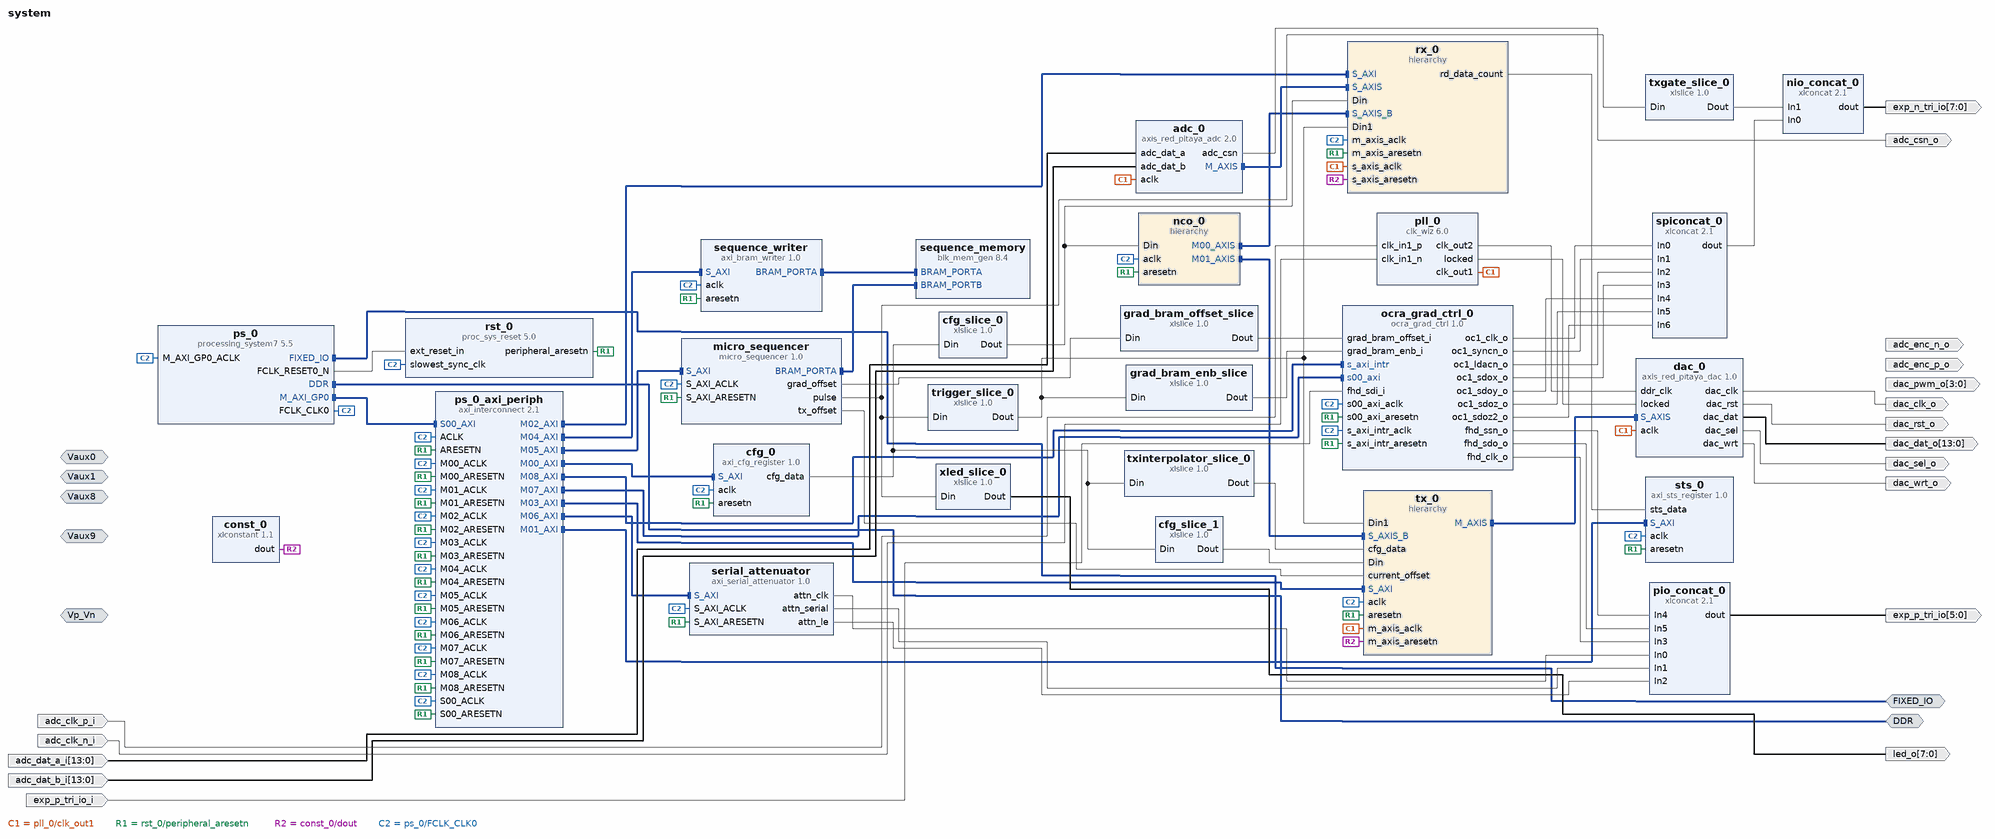
[diagram p0: block diagram of the top level]
# Vivado block design system, xc7z010clg400-1, Vivado 2019.2
create_bd_design system

create_bd_intf_port -mode Slave -vlnv xilinx.com:interface:diff_analog_io_rtl:1.0 Vp_Vn
create_bd_intf_port -mode Slave -vlnv xilinx.com:interface:diff_analog_io_rtl:1.0 Vaux0
create_bd_intf_port -mode Slave -vlnv xilinx.com:interface:diff_analog_io_rtl:1.0 Vaux1
create_bd_intf_port -mode Slave -vlnv xilinx.com:interface:diff_analog_io_rtl:1.0 Vaux9
create_bd_intf_port -mode Slave -vlnv xilinx.com:interface:diff_analog_io_rtl:1.0 Vaux8
create_bd_intf_port -mode Master -vlnv xilinx.com:interface:ddrx_rtl:1.0 DDR
create_bd_intf_port -mode Master -vlnv xilinx.com:display_processing_system7:fixedio_rtl:1.0 FIXED_IO
create_bd_port -dir I -from 13 -to 0 adc_dat_a_i
create_bd_port -dir I -from 13 -to 0 adc_dat_b_i
create_bd_port -dir I adc_clk_p_i
create_bd_port -dir I adc_clk_n_i
create_bd_port -dir O adc_enc_p_o
create_bd_port -dir O adc_enc_n_o
create_bd_port -dir O adc_csn_o
create_bd_port -dir O -from 13 -to 0 dac_dat_o
create_bd_port -dir O dac_clk_o
create_bd_port -dir O dac_rst_o
create_bd_port -dir O dac_sel_o
create_bd_port -dir O dac_wrt_o
create_bd_port -dir O -from 3 -to 0 dac_pwm_o
create_bd_port -dir O -from 7 -to 0 led_o
create_bd_port -dir O -from 5 -to 0 exp_p_tri_io
create_bd_port -dir O -from 7 -to 0 exp_n_tri_io
create_bd_port -dir I -type data exp_p_tri_io_i

create_bd_cell -type ip -vlnv xilinx.com:ip:processing_system7:5.5 ps_0
set_property -dict [list \
  CONFIG.PCW_APU_PERIPHERAL_FREQMHZ 666.666666 \
  CONFIG.PCW_ENET0_ENET0_IO {MIO 16 .. 27} \
  CONFIG.PCW_ENET0_GRP_MDIO_ENABLE 1 \
  CONFIG.PCW_ENET0_GRP_MDIO_IO {MIO 52 .. 53} \
  CONFIG.PCW_ENET0_PERIPHERAL_ENABLE 1 \
  CONFIG.PCW_ENET0_RESET_ENABLE 0 \
  CONFIG.PCW_ENET_RESET_ENABLE 1 \
  CONFIG.PCW_ENET_RESET_SELECT {Share reset pin} \
  CONFIG.PCW_FPGA0_PERIPHERAL_FREQMHZ 143 \
  CONFIG.PCW_FPGA1_PERIPHERAL_FREQMHZ 50 \
  CONFIG.PCW_GPIO_EMIO_GPIO_ENABLE 1 \
  CONFIG.PCW_GPIO_EMIO_GPIO_IO 64 \
  CONFIG.PCW_GPIO_MIO_GPIO_ENABLE 1 \
  CONFIG.PCW_GPIO_MIO_GPIO_IO MIO \
  CONFIG.PCW_GPIO_PERIPHERAL_ENABLE 1 \
  CONFIG.PCW_I2C0_GRP_INT_ENABLE 0 \
  CONFIG.PCW_I2C0_I2C0_IO {MIO 50 .. 51} \
  CONFIG.PCW_I2C0_PERIPHERAL_ENABLE 1 \
  CONFIG.PCW_I2C_PERIPHERAL_FREQMHZ 111.111115 \
  CONFIG.PCW_I2C_RESET_ENABLE 1 \
  CONFIG.PCW_I2C_RESET_SELECT {Share reset pin} \
  CONFIG.PCW_IMPORT_BOARD_PRESET cfg/red_pitaya.xml \
  CONFIG.PCW_PRESET_BANK1_VOLTAGE {LVCMOS 2.5V} \
  CONFIG.PCW_QSPI_GRP_SINGLE_SS_ENABLE 1 \
  CONFIG.PCW_QSPI_GRP_SINGLE_SS_IO {MIO 1 .. 6} \
  CONFIG.PCW_QSPI_PERIPHERAL_ENABLE 1 \
  CONFIG.PCW_QSPI_PERIPHERAL_FREQMHZ 125 \
  CONFIG.PCW_QSPI_QSPI_IO {MIO 1 .. 6} \
  CONFIG.PCW_SD0_GRP_CD_ENABLE 1 \
  CONFIG.PCW_SD0_GRP_CD_IO {MIO 46} \
  CONFIG.PCW_SD0_GRP_WP_ENABLE 1 \
  CONFIG.PCW_SD0_GRP_WP_IO {MIO 47} \
  CONFIG.PCW_SD0_PERIPHERAL_ENABLE 1 \
  CONFIG.PCW_SD0_SD0_IO {MIO 40 .. 45} \
  CONFIG.PCW_SDIO_PERIPHERAL_FREQMHZ 100 \
  CONFIG.PCW_SINGLE_QSPI_DATA_MODE x4 \
  CONFIG.PCW_SPI0_PERIPHERAL_ENABLE 1 \
  CONFIG.PCW_SPI0_SPI0_IO EMIO \
  CONFIG.PCW_SPI1_PERIPHERAL_ENABLE 1 \
  CONFIG.PCW_SPI1_SPI1_IO {MIO 10 .. 15} \
  CONFIG.PCW_TTC0_PERIPHERAL_ENABLE 1 \
  CONFIG.PCW_TTC0_TTC0_IO EMIO \
  CONFIG.PCW_UART0_PERIPHERAL_ENABLE 1 \
  CONFIG.PCW_UART0_UART0_IO {MIO 14 .. 15} \
  CONFIG.PCW_UART1_PERIPHERAL_ENABLE 1 \
  CONFIG.PCW_UART1_UART1_IO {MIO 8 .. 9} \
  CONFIG.PCW_UART_PERIPHERAL_FREQMHZ 100 \
  CONFIG.PCW_UIPARAM_DDR_BUS_WIDTH {16 Bit} \
  CONFIG.PCW_UIPARAM_DDR_FREQ_MHZ 533.333333 \
  CONFIG.PCW_UIPARAM_DDR_PARTNO {MT41J256M16 RE-125} \
  CONFIG.PCW_USB0_PERIPHERAL_ENABLE 1 \
  CONFIG.PCW_USB0_RESET_ENABLE 1 \
  CONFIG.PCW_USB0_RESET_IO {MIO 48} \
  CONFIG.PCW_USB0_USB0_IO {MIO 28 .. 39} \
  CONFIG.PCW_USB_RESET_ENABLE 1 \
  CONFIG.PCW_USB_RESET_SELECT {Share reset pin} \
] [get_bd_cells ps_0]
# 430 more settings of ps_0 are not shown: defaults, MIO pin electricals, DDR timing, and values the tool derives
create_bd_cell -type ip -vlnv xilinx.com:ip:proc_sys_reset:5.0 rst_0
create_bd_cell -type ip -vlnv xilinx.com:ip:clk_wiz:6.0 pll_0
set_property -dict [list \
  CONFIG.CLKOUT1_REQUESTED_OUT_FREQ 125.0 \
  CONFIG.CLKOUT1_USED true \
  CONFIG.CLKOUT2_REQUESTED_OUT_FREQ 250.0 \
  CONFIG.CLKOUT2_REQUESTED_PHASE -90.0 \
  CONFIG.CLKOUT2_USED true \
  CONFIG.PRIMITIVE PLL \
  CONFIG.PRIM_IN_FREQ 125.0 \
  CONFIG.PRIM_SOURCE Differential_clock_capable_pin \
  CONFIG.USE_RESET false \
] [get_bd_cells pll_0]
create_bd_cell -type ip -vlnv pavel-demin:user:axis_red_pitaya_adc:2.0 adc_0
create_bd_cell -type ip -vlnv pavel-demin:user:axis_red_pitaya_dac:1.0 dac_0
create_bd_cell -type ip -vlnv pavel-demin:user:axi_cfg_register:1.0 cfg_0
set_property -dict {CONFIG.AXI_ADDR_WIDTH 32 CONFIG.AXI_DATA_WIDTH 32 CONFIG.CFG_DATA_WIDTH 128} [get_bd_cells cfg_0]
create_bd_cell -type ip -vlnv xilinx.com:ip:xlslice:1.0 txinterpolator_slice_0
set_property -dict [list \
  CONFIG.DIN_FROM 31 \
  CONFIG.DIN_TO 0 \
  CONFIG.DIN_WIDTH 128 \
  CONFIG.DOUT_WIDTH 32 \
] [get_bd_cells txinterpolator_slice_0]
create_bd_cell -type ip -vlnv xilinx.com:ip:xlslice:1.0 cfg_slice_0
set_property -dict {CONFIG.DIN_FROM 95 CONFIG.DIN_TO 32 CONFIG.DIN_WIDTH 128 CONFIG.DOUT_WIDTH 64} [get_bd_cells cfg_slice_0]
create_bd_cell -type ip -vlnv xilinx.com:ip:xlslice:1.0 cfg_slice_1
set_property -dict {CONFIG.DIN_FROM 127 CONFIG.DIN_TO 96 CONFIG.DIN_WIDTH 128 CONFIG.DOUT_WIDTH 32} [get_bd_cells cfg_slice_1]
create_bd_cell -type ip -vlnv xilinx.com:ip:xlconstant:1.1 const_0
create_bd_cell -type hier rx_0
create_bd_cell -type hier tx_0
create_bd_cell -type hier nco_0
create_bd_cell -type ip -vlnv pavel-demin:user:axi_sts_register:1.0 sts_0
set_property -dict {CONFIG.AXI_ADDR_WIDTH 32 CONFIG.AXI_DATA_WIDTH 32 CONFIG.STS_DATA_WIDTH 32} [get_bd_cells sts_0]
create_bd_cell -type ip -vlnv xilinx.com:ip:axi_interconnect:2.1 ps_0_axi_periph
set_property -dict {CONFIG.ENABLE_ADVANCED_OPTIONS 0 CONFIG.NUM_MI 9} [get_bd_cells ps_0_axi_periph]
create_bd_cell -type ip -vlnv xilinx.com:ip:blk_mem_gen:8.4 sequence_memory
set_property -dict [list \
  CONFIG.Enable_A Always_Enabled \
  CONFIG.Enable_B Always_Enabled \
  CONFIG.Memory_Type Simple_Dual_Port_RAM \
  CONFIG.Register_PortB_Output_of_Memory_Core false \
  CONFIG.Register_PortB_Output_of_Memory_Primitives true \
  CONFIG.Write_Depth_A 16384 \
  CONFIG.Write_Width_A 32 \
  CONFIG.Write_Width_B 64 \
  CONFIG.use_bram_block Stand_Alone \
] [get_bd_cells sequence_memory]
create_bd_cell -type ip -vlnv pavel-demin:user:axi_bram_writer:1.0 sequence_writer
set_property -dict [list \
  CONFIG.AXI_ADDR_WIDTH 32 \
  CONFIG.AXI_DATA_WIDTH 32 \
  CONFIG.BRAM_ADDR_WIDTH 14 \
  CONFIG.BRAM_DATA_WIDTH 32 \
] [get_bd_cells sequence_writer]
create_bd_cell -type ip -vlnv open-mri:user:micro_sequencer:1.0 micro_sequencer
set_property -dict [list \
  CONFIG.BRAM_ADDR_WIDTH 13 \
  CONFIG.BRAM_DATA_WIDTH 64 \
  CONFIG.C_S_AXI_ADDR_WIDTH 32 \
  CONFIG.C_S_AXI_DATA_WIDTH 32 \
] [get_bd_cells micro_sequencer]
create_bd_cell -type ip -vlnv open-mri:user:axi_serial_attenuator:1.0 serial_attenuator
set_property -dict {CONFIG.C_S_AXI_ADDR_WIDTH 16 CONFIG.C_S_AXI_DATA_WIDTH 32} [get_bd_cells serial_attenuator]
create_bd_cell -type ip -vlnv xilinx.com:ip:xlslice:1.0 xled_slice_0
set_property -dict {CONFIG.DIN_FROM 15 CONFIG.DIN_TO 8 CONFIG.DIN_WIDTH 64 CONFIG.DOUT_WIDTH 8} [get_bd_cells xled_slice_0]
create_bd_cell -type ip -vlnv xilinx.com:ip:xlslice:1.0 trigger_slice_0
set_property -dict {CONFIG.DIN_FROM 7 CONFIG.DIN_TO 0 CONFIG.DIN_WIDTH 64 CONFIG.DOUT_WIDTH 8} [get_bd_cells trigger_slice_0]
create_bd_cell -type ip -vlnv xilinx.com:ip:xlslice:1.0 txgate_slice_0
set_property -dict {CONFIG.DIN_FROM 4 CONFIG.DIN_TO 4 CONFIG.DIN_WIDTH 64 CONFIG.DOUT_WIDTH 1} [get_bd_cells txgate_slice_0]
create_bd_cell -type ip -vlnv xilinx.com:ip:xlconcat:2.1 nio_concat_0
set_property -dict {CONFIG.NUM_PORTS 2} [get_bd_cells nio_concat_0]
create_bd_cell -type ip -vlnv xilinx.com:ip:xlconcat:2.1 pio_concat_0
set_property -dict {CONFIG.NUM_PORTS 6} [get_bd_cells pio_concat_0]
create_bd_cell -type ip -vlnv xilinx.com:ip:xlslice:1.0 grad_bram_offset_slice
set_property -dict {CONFIG.DIN_FROM 13 CONFIG.DIN_WIDTH 16 CONFIG.DOUT_WIDTH 14} [get_bd_cells grad_bram_offset_slice]
create_bd_cell -type ip -vlnv xilinx.com:ip:xlslice:1.0 grad_bram_enb_slice
set_property -dict {CONFIG.DIN_FROM 2 CONFIG.DIN_TO 2 CONFIG.DIN_WIDTH 8 CONFIG.DOUT_WIDTH 1} [get_bd_cells grad_bram_enb_slice]
create_bd_cell -type ip -vlnv xilinx.com:ip:xlconcat:2.1 spiconcat_0
set_property -dict {CONFIG.NUM_PORTS 7} [get_bd_cells spiconcat_0]
create_bd_cell -type ip -vlnv ocra:ocra:ocra_grad_ctrl:1.0 ocra_grad_ctrl_0

# ---- hierarchy /rx_0 ----
current_bd_instance /rx_0
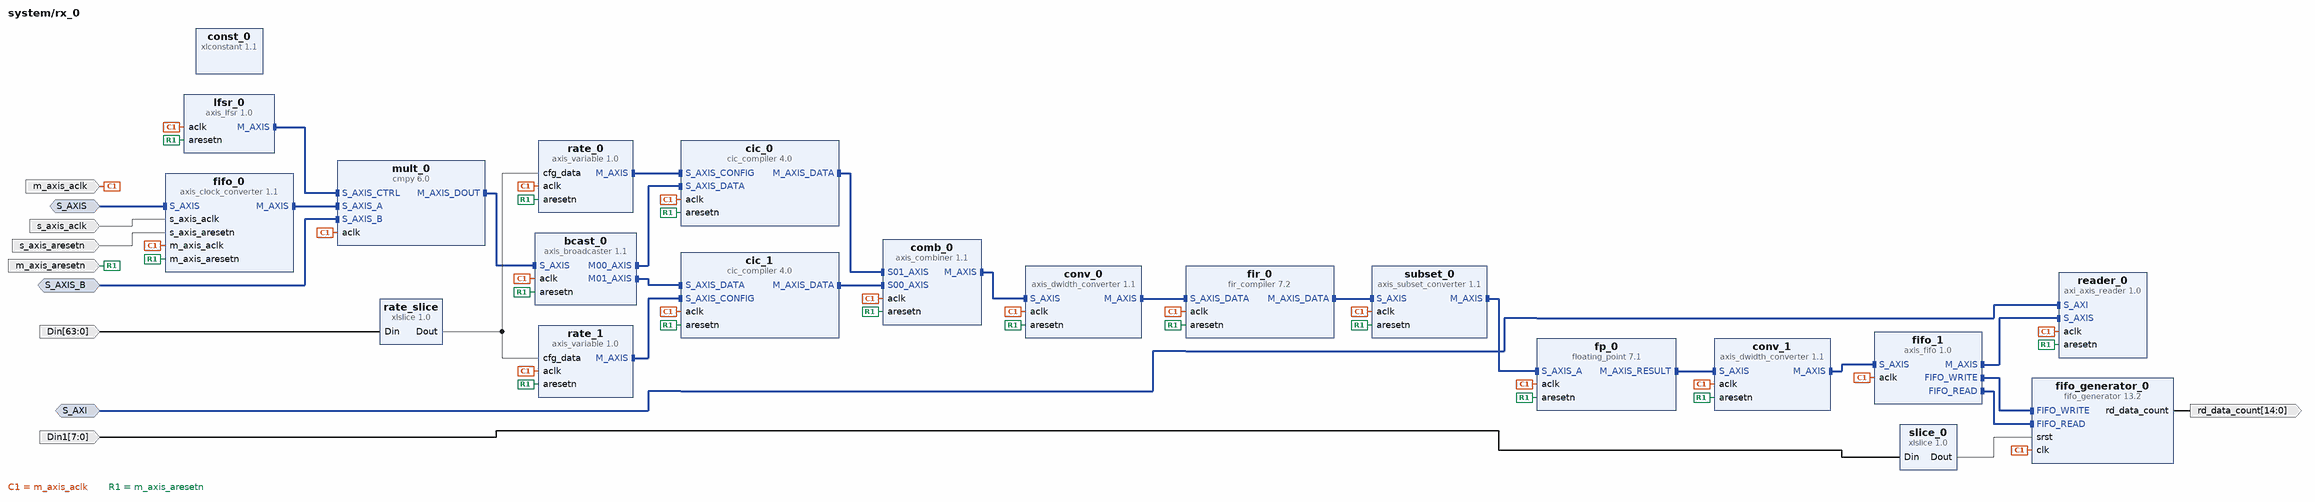
[diagram p1: block diagram inside /rx_0]
create_bd_intf_pin -mode Slave -vlnv xilinx.com:interface:axis_rtl:1.0 S_AXIS
create_bd_intf_pin -mode Slave -vlnv xilinx.com:interface:axis_rtl:1.0 S_AXIS_B
create_bd_intf_pin -mode Slave -vlnv xilinx.com:interface:aximm_rtl:1.0 S_AXI
create_bd_pin -dir I -type clk m_axis_aclk
create_bd_pin -dir I -type rst m_axis_aresetn
create_bd_pin -dir I -from 63 -to 0 Din
create_bd_pin -dir I -type clk s_axis_aclk
create_bd_pin -dir I -type rst s_axis_aresetn
create_bd_pin -dir O -from 14 -to 0 rd_data_count
create_bd_pin -dir I -from 7 -to 0 Din1

create_bd_cell -type ip -vlnv xilinx.com:ip:xlslice:1.0 slice_0
set_property -dict {CONFIG.DIN_FROM 1 CONFIG.DIN_TO 1 CONFIG.DIN_WIDTH 8 CONFIG.DOUT_WIDTH 1} [get_bd_cells slice_0]
create_bd_cell -type ip -vlnv xilinx.com:ip:xlslice:1.0 rate_slice
set_property -dict {CONFIG.DIN_FROM 47 CONFIG.DIN_TO 32 CONFIG.DIN_WIDTH 64 CONFIG.DOUT_WIDTH 16} [get_bd_cells rate_slice]
create_bd_cell -type ip -vlnv xilinx.com:ip:xlconstant:1.1 const_0
create_bd_cell -type ip -vlnv xilinx.com:ip:axis_clock_converter:1.1 fifo_0
set_property -dict {CONFIG.TDATA_NUM_BYTES 2} [get_bd_cells fifo_0]
create_bd_cell -type ip -vlnv pavel-demin:user:axis_lfsr:1.0 lfsr_0
create_bd_cell -type ip -vlnv xilinx.com:ip:cmpy:6.0 mult_0
set_property -dict [list \
  CONFIG.APortWidth 14 \
  CONFIG.BPortWidth 24 \
  CONFIG.FlowControl Blocking \
  CONFIG.OutputWidth 26 \
  CONFIG.RoundMode Random_Rounding \
] [get_bd_cells mult_0]
create_bd_cell -type ip -vlnv xilinx.com:ip:axis_broadcaster:1.1 bcast_0
set_property -dict [list \
  CONFIG.M00_TDATA_REMAP {tdata[23:0]} \
  CONFIG.M01_TDATA_REMAP {tdata[55:32]} \
  CONFIG.M_TDATA_NUM_BYTES 3 \
  CONFIG.S_TDATA_NUM_BYTES 8 \
] [get_bd_cells bcast_0]
create_bd_cell -type ip -vlnv pavel-demin:user:axis_variable:1.0 rate_0
set_property -dict {CONFIG.AXIS_TDATA_WIDTH 16} [get_bd_cells rate_0]
create_bd_cell -type ip -vlnv pavel-demin:user:axis_variable:1.0 rate_1
set_property -dict {CONFIG.AXIS_TDATA_WIDTH 16} [get_bd_cells rate_1]
create_bd_cell -type ip -vlnv xilinx.com:ip:cic_compiler:4.0 cic_0
set_property -dict [list \
  CONFIG.Clock_Frequency 125 \
  CONFIG.Filter_Type Decimation \
  CONFIG.Fixed_Or_Initial_Rate 625 \
  CONFIG.HAS_ARESETN true \
  CONFIG.HAS_DOUT_TREADY true \
  CONFIG.Input_Data_Width 24 \
  CONFIG.Input_Sample_Frequency 125 \
  CONFIG.Maximum_Rate 8192 \
  CONFIG.Minimum_Rate 25 \
  CONFIG.Number_Of_Stages 6 \
  CONFIG.Output_Data_Width 24 \
  CONFIG.Quantization Truncation \
  CONFIG.Sample_Rate_Changes Programmable \
  CONFIG.Use_Xtreme_DSP_Slice false \
] [get_bd_cells cic_0]
create_bd_cell -type ip -vlnv xilinx.com:ip:cic_compiler:4.0 cic_1
set_property -dict [list \
  CONFIG.Clock_Frequency 125 \
  CONFIG.Filter_Type Decimation \
  CONFIG.Fixed_Or_Initial_Rate 625 \
  CONFIG.HAS_ARESETN true \
  CONFIG.HAS_DOUT_TREADY true \
  CONFIG.Input_Data_Width 24 \
  CONFIG.Input_Sample_Frequency 125 \
  CONFIG.Maximum_Rate 8192 \
  CONFIG.Minimum_Rate 25 \
  CONFIG.Number_Of_Stages 6 \
  CONFIG.Output_Data_Width 24 \
  CONFIG.Quantization Truncation \
  CONFIG.Sample_Rate_Changes Programmable \
  CONFIG.Use_Xtreme_DSP_Slice false \
] [get_bd_cells cic_1]
create_bd_cell -type ip -vlnv xilinx.com:ip:axis_combiner:1.1 comb_0
set_property -dict {CONFIG.TDATA_NUM_BYTES 3} [get_bd_cells comb_0]
create_bd_cell -type ip -vlnv xilinx.com:ip:axis_dwidth_converter:1.1 conv_0
set_property -dict {CONFIG.M_TDATA_NUM_BYTES 3 CONFIG.S_TDATA_NUM_BYTES 6} [get_bd_cells conv_0]
create_bd_cell -type ip -vlnv xilinx.com:ip:fir_compiler:7.2 fir_0
set_property -dict [list \
  CONFIG.BestPrecision true \
  CONFIG.Clock_Frequency 125 \
  CONFIG.CoefficientVector {-1.6472113056e-08, -4.7275060561e-08, -7.7431048180e-10, 3.0903860136e-08, 1.8580664775e-08, 3.2714281320e-08, -6.2515870285e-09, -1.5212421546e-07, -8.3024102014e-08, 3.1421287283e-07, 3.0541061907e-07, -4.7367916408e-07, -7.1290982678e-07, 5.4673392936e-07, 1.3334649132e-06, -4.1364098644e-07, -2.1485949525e-06, -6.7829977410e-08, 3.0726845332e-06, 1.0362499293e-06, -3.9407657887e-06, -2.5897362011e-06, 4.5112332508e-06, 4.7436885121e-06, -4.4887077258e-06, -7.3916945269e-06, 3.5688710327e-06, 1.0280353312e-05, -1.5024372933e-06, -1.3009229990e-05, -1.8303781261e-06, 1.5064716289e-05, 6.3487776401e-06, -1.5891625499e-05, -1.1721675486e-05, 1.4997961053e-05, 1.7356048979e-05, -1.2084227227e-05, -2.2446408027e-05, 7.1644345011e-06, 2.6079710827e-05, -6.6454989299e-07, -2.7404912150e-05, -6.5427500664e-06, 2.5842003924e-05, 1.3190154000e-05, -2.1299612136e-05, -1.7771633363e-05, 1.4356250995e-05, 1.8800552428e-05, -6.3558764252e-06, -1.5147259248e-05, -6.2897066014e-07, 6.4094323907e-06, 3.9982503227e-06, 6.7506282624e-06, -9.9796014867e-07, -2.2380212454e-05, -1.0759547197e-05, 3.7195306717e-05, 3.2677486281e-05, -4.6811898990e-05, -6.4599447382e-05, 4.6210324771e-05, 1.0431120674e-04, -3.0503826568e-05, -1.4732577300e-04, -4.1258453650e-06, 1.8701663321e-04, 5.9427713818e-05, -2.1517847459e-04, -1.3418896425e-04, 2.2301952102e-04, 2.2363993628e-04, -2.0251435162e-04, -3.1934040767e-04, 1.4796009669e-04, 4.0968443718e-04, -5.7507336159e-05, -4.8108463752e-04, -6.5614839363e-05, 5.1978739429e-04, 2.1246715982e-04, -5.1416395507e-04, -3.6866549936e-04, 4.5707019142e-04, 5.1550012249e-04, -3.4818706949e-04, -6.3230445935e-04, 1.9550609650e-04, 6.9955714665e-04, -1.5827253275e-05, -7.0258143521e-04, -1.6617637952e-04, 6.3529569901e-04, 3.2048789072e-04, -5.0340105072e-04, -4.1582530241e-04, 3.2634180427e-04, 4.2496083963e-04, -1.3743221406e-04, -3.3071450507e-04, -1.8305167738e-05, 1.3182485134e-04, 8.8784066371e-05, 1.5224742206e-04, -2.1850002011e-05, -4.7861967162e-04, -2.2609003083e-04, 7.8079557647e-04, 6.7984527906e-04, -9.7283144780e-04, -1.3363233256e-03, 9.5648007150e-04, 2.1563565688e-03, -6.3230621305e-04, -3.0596594938e-03, -8.6386881070e-05, 3.9239359768e-03, 1.2579439516e-03, -4.5890114465e-03, -2.8966063910e-03, 4.8663498835e-03, 4.9583669373e-03, -4.5537073976e-03, -7.3301527521e-03, 3.4540124085e-03, 9.8237515984e-03, -1.3969575800e-03, -1.2175276174e-02, -1.7386657056e-03, 1.4049779174e-02, 6.0029171665e-03, -1.5052324818e-02, -1.1359609346e-02, 1.4735662483e-02, 1.7670980642e-02, -1.2608162870e-02, -2.4690698016e-02, 8.1251717279e-03, 3.2057724080e-02, -6.4695302151e-04, -3.9282618887e-02, -1.0679394699e-02, 4.5698136555e-02, 2.7221106971e-02, -5.0282300258e-02, -5.1663864823e-02, 5.0987249628e-02, 9.0485392483e-02, -4.1603111790e-02, -1.6361436263e-01, -1.0704456365e-02, 3.5628695792e-01, 5.5459922084e-01, 3.5628695792e-01, -1.0704456365e-02, -1.6361436263e-01, -4.1603111790e-02, 9.0485392483e-02, 5.0987249628e-02, -5.1663864823e-02, -5.0282300258e-02, 2.7221106971e-02, 4.5698136555e-02, -1.0679394699e-02, -3.9282618887e-02, -6.4695302151e-04, 3.2057724080e-02, 8.1251717279e-03, -2.4690698016e-02, -1.2608162870e-02, 1.7670980642e-02, 1.4735662483e-02, -1.1359609346e-02, -1.5052324818e-02, 6.0029171665e-03, 1.4049779174e-02, -1.7386657056e-03, -1.2175276174e-02, -1.3969575800e-03, 9.8237515984e-03, 3.4540124085e-03, -7.3301527521e-03, -4.5537073976e-03, 4.9583669373e-03, 4.8663498835e-03, -2.8966063910e-03, -4.5890114465e-03, 1.2579439516e-03, 3.9239359768e-03, -8.6386881070e-05, -3.0596594938e-03, -6.3230621305e-04, 2.1563565688e-03, 9.5648007150e-04, -1.3363233256e-03, -9.7283144780e-04, 6.7984527906e-04, 7.8079557647e-04, -2.2609003083e-04, -4.7861967162e-04, -2.1850002011e-05, 1.5224742206e-04, 8.8784066371e-05, 1.3182485134e-04, -1.8305167738e-05, -3.3071450507e-04, -1.3743221406e-04, 4.2496083963e-04, 3.2634180427e-04, -4.1582530241e-04, -5.0340105072e-04, 3.2048789072e-04, 6.3529569901e-04, -1.6617637952e-04, -7.0258143521e-04, -1.5827253275e-05, 6.9955714665e-04, 1.9550609650e-04, -6.3230445935e-04, -3.4818706949e-04, 5.1550012249e-04, 4.5707019142e-04, -3.6866549936e-04, -5.1416395507e-04, 2.1246715982e-04, 5.1978739429e-04, -6.5614839363e-05, -4.8108463752e-04, -5.7507336159e-05, 4.0968443718e-04, 1.4796009669e-04, -3.1934040767e-04, -2.0251435162e-04, 2.2363993628e-04, 2.2301952102e-04, -1.3418896425e-04, -2.1517847459e-04, 5.9427713818e-05, 1.8701663321e-04, -4.1258453650e-06, -1.4732577300e-04, -3.0503826568e-05, 1.0431120674e-04, 4.6210324771e-05, -6.4599447382e-05, -4.6811898990e-05, 3.2677486281e-05, 3.7195306717e-05, -1.0759547197e-05, -2.2380212454e-05, -9.9796014867e-07, 6.7506282624e-06, 3.9982503227e-06, 6.4094323907e-06, -6.2897066014e-07, -1.5147259248e-05, -6.3558764252e-06, 1.8800552428e-05, 1.4356250995e-05, -1.7771633363e-05, -2.1299612136e-05, 1.3190154000e-05, 2.5842003924e-05, -6.5427500664e-06, -2.7404912150e-05, -6.6454989299e-07, 2.6079710827e-05, 7.1644345011e-06, -2.2446408027e-05, -1.2084227227e-05, 1.7356048979e-05, 1.4997961053e-05, -1.1721675486e-05, -1.5891625499e-05, 6.3487776401e-06, 1.5064716289e-05, -1.8303781261e-06, -1.3009229990e-05, -1.5024372933e-06, 1.0280353312e-05, 3.5688710327e-06, -7.3916945269e-06, -4.4887077258e-06, 4.7436885121e-06, 4.5112332508e-06, -2.5897362011e-06, -3.9407657887e-06, 1.0362499293e-06, 3.0726845332e-06, -6.7829977410e-08, -2.1485949525e-06, -4.1364098644e-07, 1.3334649132e-06, 5.4673392936e-07, -7.1290982678e-07, -4.7367916408e-07, 3.0541061907e-07, 3.1421287283e-07, -8.3024102014e-08, -1.5212421546e-07, -6.2515870285e-09, 3.2714281320e-08, 1.8580664775e-08, 3.0903860136e-08, -7.7431048180e-10, -4.7275060561e-08, -1.6472113056e-08} \
  CONFIG.Coefficient_Width 24 \
  CONFIG.Data_Width 24 \
  CONFIG.Decimation_Rate 2 \
  CONFIG.Filter_Type Decimation \
  CONFIG.Has_ARESETn true \
  CONFIG.M_DATA_Has_TREADY true \
  CONFIG.Number_Channels 2 \
  CONFIG.Number_Paths 1 \
  CONFIG.Output_Rounding_Mode Convergent_Rounding_to_Even \
  CONFIG.Output_Width 26 \
  CONFIG.Quantization Quantize_Only \
  CONFIG.Sample_Frequency 5.0 \
] [get_bd_cells fir_0]
create_bd_cell -type ip -vlnv xilinx.com:ip:axis_subset_converter:1.1 subset_0
set_property -dict [list \
  CONFIG.M_TDATA_NUM_BYTES 3 \
  CONFIG.S_TDATA_NUM_BYTES 4 \
  CONFIG.TDATA_REMAP {tdata[23:0]} \
] [get_bd_cells subset_0]
create_bd_cell -type ip -vlnv xilinx.com:ip:floating_point:7.1 fp_0
set_property -dict [list \
  CONFIG.A_Precision_Type Custom \
  CONFIG.C_A_Exponent_Width 2 \
  CONFIG.C_A_Fraction_Width 22 \
  CONFIG.Has_ARESETn true \
  CONFIG.Operation_Type Fixed_to_float \
  CONFIG.Result_Precision_Type Single \
] [get_bd_cells fp_0]
create_bd_cell -type ip -vlnv xilinx.com:ip:axis_dwidth_converter:1.1 conv_1
set_property -dict {CONFIG.M_TDATA_NUM_BYTES 8 CONFIG.S_TDATA_NUM_BYTES 4} [get_bd_cells conv_1]
create_bd_cell -type ip -vlnv xilinx.com:ip:fifo_generator:13.2 fifo_generator_0
set_property -dict [list \
  CONFIG.Input_Data_Width 64 \
  CONFIG.Input_Depth 8192 \
  CONFIG.Output_Data_Width 32 \
  CONFIG.Performance_Options First_Word_Fall_Through \
  CONFIG.Read_Data_Count true \
  CONFIG.Read_Data_Count_Width 15 \
] [get_bd_cells fifo_generator_0]
create_bd_cell -type ip -vlnv pavel-demin:user:axis_fifo:1.0 fifo_1
set_property -dict {CONFIG.M_AXIS_TDATA_WIDTH 32 CONFIG.S_AXIS_TDATA_WIDTH 64} [get_bd_cells fifo_1]
create_bd_cell -type ip -vlnv pavel-demin:user:axi_axis_reader:1.0 reader_0
set_property -dict {CONFIG.AXI_DATA_WIDTH 32} [get_bd_cells reader_0]

# ---- hierarchy /tx_0 ----
current_bd_instance /tx_0
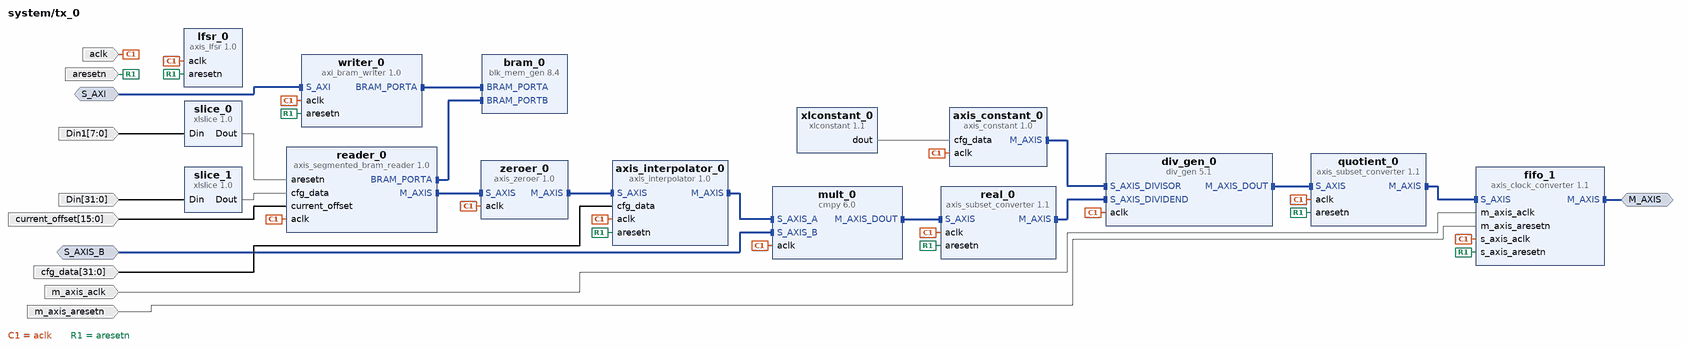
[diagram p2: block diagram inside /tx_0]
create_bd_intf_pin -mode Master -vlnv xilinx.com:interface:axis_rtl:1.0 M_AXIS
create_bd_intf_pin -mode Slave -vlnv xilinx.com:interface:axis_rtl:1.0 S_AXIS_B
create_bd_intf_pin -mode Slave -vlnv xilinx.com:interface:aximm_rtl:1.0 S_AXI
create_bd_pin -dir I -type clk aclk
create_bd_pin -dir I -type rst aresetn
create_bd_pin -dir I -from 31 -to 0 Din
create_bd_pin -dir I -from 31 -to 0 cfg_data
create_bd_pin -dir I -type clk m_axis_aclk
create_bd_pin -dir I -type rst m_axis_aresetn
create_bd_pin -dir I -from 7 -to 0 Din1
create_bd_pin -dir I -from 15 -to 0 current_offset

create_bd_cell -type ip -vlnv xilinx.com:ip:xlslice:1.0 slice_0
set_property -dict {CONFIG.DIN_FROM 0 CONFIG.DIN_TO 0 CONFIG.DIN_WIDTH 8 CONFIG.DOUT_WIDTH 1} [get_bd_cells slice_0]
create_bd_cell -type ip -vlnv xilinx.com:ip:xlslice:1.0 slice_1
set_property -dict {CONFIG.DIN_FROM 15 CONFIG.DIN_TO 0 CONFIG.DIN_WIDTH 32 CONFIG.DOUT_WIDTH 16} [get_bd_cells slice_1]
create_bd_cell -type ip -vlnv pavel-demin:user:axis_lfsr:1.0 lfsr_0
create_bd_cell -type ip -vlnv xilinx.com:ip:blk_mem_gen:8.4 bram_0
set_property -dict [list \
  CONFIG.Enable_A Always_Enabled \
  CONFIG.Enable_B Always_Enabled \
  CONFIG.Memory_Type True_Dual_Port_RAM \
  CONFIG.Register_PortB_Output_of_Memory_Primitives false \
  CONFIG.Write_Depth_A 16384 \
  CONFIG.Write_Width_A 32 \
  CONFIG.Write_Width_B 32 \
  CONFIG.use_bram_block Stand_Alone \
] [get_bd_cells bram_0]
create_bd_cell -type ip -vlnv pavel-demin:user:axi_bram_writer:1.0 writer_0
set_property -dict [list \
  CONFIG.AXI_ADDR_WIDTH 32 \
  CONFIG.AXI_DATA_WIDTH 32 \
  CONFIG.BRAM_ADDR_WIDTH 14 \
  CONFIG.BRAM_DATA_WIDTH 32 \
] [get_bd_cells writer_0]
create_bd_cell -type ip -vlnv open-mri:user:axis_segmented_bram_reader:1.0 reader_0
set_property -dict [list \
  CONFIG.AXIS_TDATA_WIDTH 32 \
  CONFIG.BRAM_ADDR_WIDTH 14 \
  CONFIG.BRAM_DATA_WIDTH 32 \
  CONFIG.CONTINUOUS FALSE \
] [get_bd_cells reader_0]
create_bd_cell -type ip -vlnv pavel-demin:user:axis_zeroer:1.0 zeroer_0
set_property -dict {CONFIG.AXIS_TDATA_WIDTH 32} [get_bd_cells zeroer_0]
create_bd_cell -type ip -vlnv pavel-demin:user:axis_interpolator:1.0 axis_interpolator_0
set_property -dict {CONFIG.AXIS_TDATA_WIDTH 32} [get_bd_cells axis_interpolator_0]
create_bd_cell -type ip -vlnv xilinx.com:ip:cmpy:6.0 mult_0
set_property -dict [list \
  CONFIG.APortWidth 16 \
  CONFIG.BPortWidth 24 \
  CONFIG.FlowControl Blocking \
  CONFIG.OutputWidth 41 \
] [get_bd_cells mult_0]
create_bd_cell -type ip -vlnv xilinx.com:ip:axis_subset_converter:1.1 real_0
set_property -dict [list \
  CONFIG.M_TDATA_NUM_BYTES 2 \
  CONFIG.S_TDATA_NUM_BYTES 10 \
  CONFIG.TDATA_REMAP {tdata[40:25]} \
] [get_bd_cells real_0]
create_bd_cell -type ip -vlnv xilinx.com:ip:axis_subset_converter:1.1 quotient_0
set_property -dict [list \
  CONFIG.M_TDATA_NUM_BYTES 2 \
  CONFIG.S_TDATA_NUM_BYTES 4 \
  CONFIG.TDATA_REMAP {tdata[31:16]} \
] [get_bd_cells quotient_0]
create_bd_cell -type ip -vlnv xilinx.com:ip:axis_clock_converter:1.1 fifo_1
set_property -dict {CONFIG.TDATA_NUM_BYTES 2} [get_bd_cells fifo_1]
create_bd_cell -type ip -vlnv xilinx.com:ip:div_gen:5.1 div_gen_0
create_bd_cell -type ip -vlnv pavel-demin:user:axis_constant:1.0 axis_constant_0
set_property -dict {CONFIG.AXIS_TDATA_WIDTH 16} [get_bd_cells axis_constant_0]
create_bd_cell -type ip -vlnv xilinx.com:ip:xlconstant:1.1 xlconstant_0
set_property -dict {CONFIG.CONST_VAL 1 CONFIG.CONST_WIDTH 16} [get_bd_cells xlconstant_0]

# ---- hierarchy /nco_0 ----
current_bd_instance /nco_0
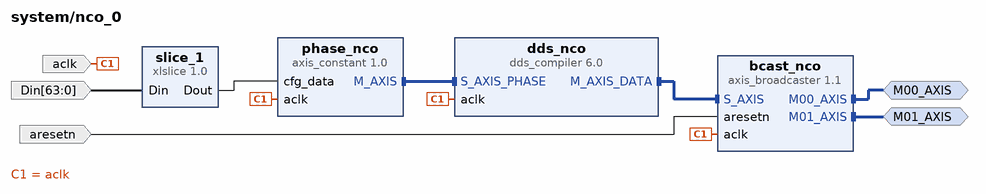
[diagram p3: block diagram inside /nco_0]
create_bd_intf_pin -mode Master -vlnv xilinx.com:interface:axis_rtl:1.0 M00_AXIS
create_bd_intf_pin -mode Master -vlnv xilinx.com:interface:axis_rtl:1.0 M01_AXIS
create_bd_pin -dir I -type clk aclk
create_bd_pin -dir I -type rst aresetn
create_bd_pin -dir I -from 63 -to 0 Din

create_bd_cell -type ip -vlnv xilinx.com:ip:xlslice:1.0 slice_1
set_property -dict {CONFIG.DIN_FROM 31 CONFIG.DIN_TO 0 CONFIG.DIN_WIDTH 64 CONFIG.DOUT_WIDTH 32} [get_bd_cells slice_1]
create_bd_cell -type ip -vlnv pavel-demin:user:axis_constant:1.0 phase_nco
set_property -dict {CONFIG.AXIS_TDATA_WIDTH 32} [get_bd_cells phase_nco]
create_bd_cell -type ip -vlnv xilinx.com:ip:dds_compiler:6.0 dds_nco
set_property -dict [list \
  CONFIG.DDS_Clock_Rate 125 \
  CONFIG.DSP48_Use Minimal \
  CONFIG.Frequency_Resolution 0.2 \
  CONFIG.Has_Phase_Out false \
  CONFIG.Has_TREADY true \
  CONFIG.Negative_Sine true \
  CONFIG.Output_Width 24 \
  CONFIG.Phase_Increment Streaming \
  CONFIG.Phase_Width 30 \
  CONFIG.Spurious_Free_Dynamic_Range 138 \
] [get_bd_cells dds_nco]
create_bd_cell -type ip -vlnv xilinx.com:ip:axis_broadcaster:1.1 bcast_nco
set_property -dict [list \
  CONFIG.M00_TDATA_REMAP {tdata[47:0]} \
  CONFIG.M01_TDATA_REMAP {tdata[47:0]} \
  CONFIG.M_TDATA_NUM_BYTES 6 \
  CONFIG.S_TDATA_NUM_BYTES 6 \
] [get_bd_cells bcast_nco]

# ---- connections ----

current_bd_instance /rx_0
connect_bd_intf_net [get_bd_intf_pins S_AXIS] [get_bd_intf_pins fifo_0/S_AXIS]
connect_bd_intf_net [get_bd_intf_pins comb_0/S00_AXIS] [get_bd_intf_pins cic_1/M_AXIS_DATA]
connect_bd_intf_net [get_bd_intf_pins subset_0/S_AXIS] [get_bd_intf_pins fir_0/M_AXIS_DATA]
connect_bd_intf_net [get_bd_intf_pins conv_1/S_AXIS] [get_bd_intf_pins fp_0/M_AXIS_RESULT]
connect_bd_intf_net [get_bd_intf_pins comb_0/S01_AXIS] [get_bd_intf_pins cic_0/M_AXIS_DATA]
connect_bd_intf_net [get_bd_intf_pins fp_0/S_AXIS_A] [get_bd_intf_pins subset_0/M_AXIS]
connect_bd_intf_net [get_bd_intf_pins fifo_1/FIFO_WRITE] [get_bd_intf_pins fifo_generator_0/FIFO_WRITE]
connect_bd_intf_net [get_bd_intf_pins reader_0/S_AXIS] [get_bd_intf_pins fifo_1/M_AXIS]
connect_bd_intf_net [get_bd_intf_pins fifo_1/FIFO_READ] [get_bd_intf_pins fifo_generator_0/FIFO_READ]
connect_bd_intf_net [get_bd_intf_pins mult_0/S_AXIS_A] [get_bd_intf_pins fifo_0/M_AXIS]
connect_bd_intf_net [get_bd_intf_pins fir_0/S_AXIS_DATA] [get_bd_intf_pins conv_0/M_AXIS]
connect_bd_intf_net [get_bd_intf_pins cic_1/S_AXIS_DATA] [get_bd_intf_pins bcast_0/M01_AXIS]
connect_bd_intf_net [get_bd_intf_pins mult_0/S_AXIS_CTRL] [get_bd_intf_pins lfsr_0/M_AXIS]
connect_bd_intf_net [get_bd_intf_pins S_AXIS_B] [get_bd_intf_pins mult_0/S_AXIS_B]
connect_bd_intf_net [get_bd_intf_pins fifo_1/S_AXIS] [get_bd_intf_pins conv_1/M_AXIS]
connect_bd_intf_net [get_bd_intf_pins cic_0/S_AXIS_CONFIG] [get_bd_intf_pins rate_0/M_AXIS]
connect_bd_intf_net [get_bd_intf_pins bcast_0/S_AXIS] [get_bd_intf_pins mult_0/M_AXIS_DOUT]
connect_bd_intf_net [get_bd_intf_pins conv_0/S_AXIS] [get_bd_intf_pins comb_0/M_AXIS]
connect_bd_intf_net [get_bd_intf_pins cic_1/S_AXIS_CONFIG] [get_bd_intf_pins rate_1/M_AXIS]
connect_bd_intf_net [get_bd_intf_pins cic_0/S_AXIS_DATA] [get_bd_intf_pins bcast_0/M00_AXIS]
connect_bd_intf_net [get_bd_intf_pins S_AXI] [get_bd_intf_pins reader_0/S_AXI]
connect_bd_net [get_bd_pins m_axis_aclk] \
  [get_bd_pins fifo_0/m_axis_aclk] [get_bd_pins lfsr_0/aclk] [get_bd_pins mult_0/aclk] [get_bd_pins bcast_0/aclk] \
  [get_bd_pins rate_0/aclk] [get_bd_pins rate_1/aclk] [get_bd_pins cic_0/aclk] [get_bd_pins cic_1/aclk] \
  [get_bd_pins comb_0/aclk] [get_bd_pins conv_0/aclk] [get_bd_pins fir_0/aclk] [get_bd_pins subset_0/aclk] \
  [get_bd_pins fp_0/aclk] [get_bd_pins conv_1/aclk] [get_bd_pins fifo_generator_0/clk] [get_bd_pins fifo_1/aclk] \
  [get_bd_pins reader_0/aclk]
connect_bd_net [get_bd_pins m_axis_aresetn] \
  [get_bd_pins fifo_0/m_axis_aresetn] [get_bd_pins lfsr_0/aresetn] [get_bd_pins bcast_0/aresetn] [get_bd_pins rate_0/aresetn] \
  [get_bd_pins rate_1/aresetn] [get_bd_pins cic_0/aresetn] [get_bd_pins cic_1/aresetn] [get_bd_pins comb_0/aresetn] \
  [get_bd_pins conv_0/aresetn] [get_bd_pins fir_0/aresetn] [get_bd_pins subset_0/aresetn] [get_bd_pins fp_0/aresetn] \
  [get_bd_pins conv_1/aresetn] [get_bd_pins reader_0/aresetn]
connect_bd_net [get_bd_pins rate_slice/Dout] [get_bd_pins rate_0/cfg_data] [get_bd_pins rate_1/cfg_data]
connect_bd_net [get_bd_pins slice_0/Dout] [get_bd_pins fifo_generator_0/srst]
connect_bd_net [get_bd_pins Din] [get_bd_pins rate_slice/Din]
connect_bd_net [get_bd_pins s_axis_aclk] [get_bd_pins fifo_0/s_axis_aclk]
connect_bd_net [get_bd_pins s_axis_aresetn] [get_bd_pins fifo_0/s_axis_aresetn]
connect_bd_net [get_bd_pins fifo_generator_0/rd_data_count] [get_bd_pins rd_data_count]
connect_bd_net -net Din1_1 [get_bd_pins Din1] [get_bd_pins slice_0/Din]

current_bd_instance /tx_0
connect_bd_intf_net [get_bd_intf_pins axis_interpolator_0/S_AXIS] [get_bd_intf_pins zeroer_0/M_AXIS]
connect_bd_intf_net [get_bd_intf_pins reader_0/BRAM_PORTA] [get_bd_intf_pins bram_0/BRAM_PORTB]
connect_bd_intf_net [get_bd_intf_pins writer_0/BRAM_PORTA] [get_bd_intf_pins bram_0/BRAM_PORTA]
connect_bd_intf_net [get_bd_intf_pins mult_0/S_AXIS_A] [get_bd_intf_pins axis_interpolator_0/M_AXIS]
connect_bd_intf_net [get_bd_intf_pins zeroer_0/S_AXIS] [get_bd_intf_pins reader_0/M_AXIS]
connect_bd_intf_net [get_bd_intf_pins real_0/S_AXIS] [get_bd_intf_pins mult_0/M_AXIS_DOUT]
connect_bd_intf_net [get_bd_intf_pins real_0/M_AXIS] [get_bd_intf_pins div_gen_0/S_AXIS_DIVIDEND]
connect_bd_intf_net [get_bd_intf_pins div_gen_0/M_AXIS_DOUT] [get_bd_intf_pins quotient_0/S_AXIS]
connect_bd_intf_net [get_bd_intf_pins quotient_0/M_AXIS] [get_bd_intf_pins fifo_1/S_AXIS]
connect_bd_intf_net [get_bd_intf_pins axis_constant_0/M_AXIS] [get_bd_intf_pins div_gen_0/S_AXIS_DIVISOR]
connect_bd_intf_net [get_bd_intf_pins S_AXIS_B] [get_bd_intf_pins mult_0/S_AXIS_B]
connect_bd_intf_net [get_bd_intf_pins M_AXIS] [get_bd_intf_pins fifo_1/M_AXIS]
connect_bd_intf_net [get_bd_intf_pins S_AXI] [get_bd_intf_pins writer_0/S_AXI]
connect_bd_net [get_bd_pins aclk] \
  [get_bd_pins lfsr_0/aclk] [get_bd_pins reader_0/aclk] [get_bd_pins zeroer_0/aclk] [get_bd_pins axis_interpolator_0/aclk] \
  [get_bd_pins mult_0/aclk] [get_bd_pins real_0/aclk] [get_bd_pins quotient_0/aclk] [get_bd_pins fifo_1/s_axis_aclk] \
  [get_bd_pins axis_constant_0/aclk] [get_bd_pins div_gen_0/aclk] [get_bd_pins writer_0/aclk]
connect_bd_net [get_bd_pins aresetn] \
  [get_bd_pins lfsr_0/aresetn] [get_bd_pins axis_interpolator_0/aresetn] [get_bd_pins real_0/aresetn] \
  [get_bd_pins quotient_0/aresetn] [get_bd_pins fifo_1/s_axis_aresetn] [get_bd_pins writer_0/aresetn]
connect_bd_net [get_bd_pins slice_1/Dout] [get_bd_pins reader_0/cfg_data]
connect_bd_net [get_bd_pins slice_0/Dout] [get_bd_pins reader_0/aresetn]
connect_bd_net [get_bd_pins xlconstant_0/dout] [get_bd_pins axis_constant_0/cfg_data]
connect_bd_net [get_bd_pins Din] [get_bd_pins slice_1/Din]
connect_bd_net [get_bd_pins cfg_data] [get_bd_pins axis_interpolator_0/cfg_data]
connect_bd_net [get_bd_pins m_axis_aclk] [get_bd_pins fifo_1/m_axis_aclk]
connect_bd_net [get_bd_pins m_axis_aresetn] [get_bd_pins fifo_1/m_axis_aresetn]
connect_bd_net -net Din1_1 [get_bd_pins Din1] [get_bd_pins slice_0/Din]
connect_bd_net [get_bd_pins current_offset] [get_bd_pins reader_0/current_offset]

current_bd_instance /nco_0
connect_bd_intf_net [get_bd_intf_pins dds_nco/S_AXIS_PHASE] [get_bd_intf_pins phase_nco/M_AXIS]
connect_bd_intf_net [get_bd_intf_pins bcast_nco/S_AXIS] [get_bd_intf_pins dds_nco/M_AXIS_DATA]
connect_bd_intf_net [get_bd_intf_pins M00_AXIS] [get_bd_intf_pins bcast_nco/M00_AXIS]
connect_bd_intf_net [get_bd_intf_pins M01_AXIS] [get_bd_intf_pins bcast_nco/M01_AXIS]
connect_bd_net [get_bd_pins slice_1/Dout] [get_bd_pins phase_nco/cfg_data]
connect_bd_net [get_bd_pins aclk] [get_bd_pins phase_nco/aclk] [get_bd_pins dds_nco/aclk] [get_bd_pins bcast_nco/aclk]
connect_bd_net [get_bd_pins aresetn] [get_bd_pins bcast_nco/aresetn]
connect_bd_net [get_bd_pins Din] [get_bd_pins slice_1/Din]

current_bd_instance /
connect_bd_intf_net [get_bd_intf_pins nco_0/M01_AXIS] [get_bd_intf_pins tx_0/S_AXIS_B]
connect_bd_intf_net [get_bd_intf_pins ps_0_axi_periph/M08_AXI] [get_bd_intf_pins ocra_grad_ctrl_0/s_axi_intr]
connect_bd_intf_net [get_bd_intf_pins ps_0_axi_periph/M00_AXI] [get_bd_intf_pins cfg_0/S_AXI]
connect_bd_intf_net [get_bd_intf_pins adc_0/M_AXIS] [get_bd_intf_pins rx_0/S_AXIS]
connect_bd_intf_net [get_bd_intf_pins sequence_writer/BRAM_PORTA] [get_bd_intf_pins sequence_memory/BRAM_PORTA]
connect_bd_intf_net [get_bd_intf_pins nco_0/M00_AXIS] [get_bd_intf_pins rx_0/S_AXIS_B]
connect_bd_intf_net [get_bd_intf_pins dac_0/S_AXIS] [get_bd_intf_pins tx_0/M_AXIS]
connect_bd_intf_net [get_bd_intf_pins ps_0_axi_periph/M05_AXI] [get_bd_intf_pins micro_sequencer/S_AXI]
connect_bd_intf_net [get_bd_intf_ports FIXED_IO] [get_bd_intf_pins ps_0/FIXED_IO]
connect_bd_intf_net [get_bd_intf_pins ocra_grad_ctrl_0/s00_axi] [get_bd_intf_pins ps_0_axi_periph/M07_AXI]
connect_bd_intf_net [get_bd_intf_pins ps_0_axi_periph/M04_AXI] [get_bd_intf_pins sequence_writer/S_AXI]
connect_bd_intf_net [get_bd_intf_pins ps_0/M_AXI_GP0] [get_bd_intf_pins ps_0_axi_periph/S00_AXI]
connect_bd_intf_net [get_bd_intf_pins ps_0_axi_periph/M03_AXI] [get_bd_intf_pins tx_0/S_AXI]
connect_bd_intf_net [get_bd_intf_pins ps_0_axi_periph/M06_AXI] [get_bd_intf_pins serial_attenuator/S_AXI]
connect_bd_intf_net [get_bd_intf_pins ps_0_axi_periph/M01_AXI] [get_bd_intf_pins sts_0/S_AXI]
connect_bd_intf_net [get_bd_intf_pins ps_0_axi_periph/M02_AXI] [get_bd_intf_pins rx_0/S_AXI]
connect_bd_intf_net [get_bd_intf_ports DDR] [get_bd_intf_pins ps_0/DDR]
connect_bd_intf_net [get_bd_intf_pins micro_sequencer/BRAM_PORTA] [get_bd_intf_pins sequence_memory/BRAM_PORTB]
connect_bd_net [get_bd_ports adc_clk_p_i] [get_bd_pins pll_0/clk_in1_p]
connect_bd_net [get_bd_ports adc_clk_n_i] [get_bd_pins pll_0/clk_in1_n]
connect_bd_net [get_bd_pins pll_0/clk_out1] \
  [get_bd_pins adc_0/aclk] [get_bd_pins dac_0/aclk] [get_bd_pins rx_0/s_axis_aclk] [get_bd_pins tx_0/m_axis_aclk]
connect_bd_net [get_bd_ports adc_dat_a_i] [get_bd_pins adc_0/adc_dat_a]
connect_bd_net [get_bd_ports adc_dat_b_i] [get_bd_pins adc_0/adc_dat_b]
connect_bd_net [get_bd_pins adc_0/adc_csn] [get_bd_ports adc_csn_o]
connect_bd_net [get_bd_pins pll_0/clk_out2] [get_bd_pins dac_0/ddr_clk]
connect_bd_net [get_bd_pins pll_0/locked] [get_bd_pins dac_0/locked]
connect_bd_net [get_bd_pins dac_0/dac_clk] [get_bd_ports dac_clk_o]
connect_bd_net [get_bd_pins dac_0/dac_rst] [get_bd_ports dac_rst_o]
connect_bd_net [get_bd_pins dac_0/dac_sel] [get_bd_ports dac_sel_o]
connect_bd_net [get_bd_pins dac_0/dac_wrt] [get_bd_ports dac_wrt_o]
connect_bd_net [get_bd_pins dac_0/dac_dat] [get_bd_ports dac_dat_o]
connect_bd_net [get_bd_pins cfg_0/cfg_data] [get_bd_pins txinterpolator_slice_0/Din] [get_bd_pins cfg_slice_0/Din] [get_bd_pins cfg_slice_1/Din]
connect_bd_net [get_bd_pins rst_0/peripheral_aresetn] \
  [get_bd_pins rx_0/m_axis_aresetn] [get_bd_pins tx_0/aresetn] [get_bd_pins nco_0/aresetn] \
  [get_bd_pins ps_0_axi_periph/S00_ARESETN] [get_bd_pins cfg_0/aresetn] [get_bd_pins ps_0_axi_periph/M00_ARESETN] \
  [get_bd_pins ps_0_axi_periph/ARESETN] [get_bd_pins sts_0/aresetn] [get_bd_pins ps_0_axi_periph/M01_ARESETN] \
  [get_bd_pins ps_0_axi_periph/M02_ARESETN] [get_bd_pins ps_0_axi_periph/M03_ARESETN] [get_bd_pins sequence_writer/aresetn] \
  [get_bd_pins ps_0_axi_periph/M04_ARESETN] [get_bd_pins micro_sequencer/S_AXI_ARESETN] \
  [get_bd_pins ps_0_axi_periph/M05_ARESETN] [get_bd_pins serial_attenuator/S_AXI_ARESETN] \
  [get_bd_pins ps_0_axi_periph/M06_ARESETN] [get_bd_pins ps_0_axi_periph/M07_ARESETN] \
  [get_bd_pins ps_0_axi_periph/M08_ARESETN] [get_bd_pins ocra_grad_ctrl_0/s00_axi_aresetn] \
  [get_bd_pins ocra_grad_ctrl_0/s_axi_intr_aresetn]
connect_bd_net [get_bd_pins cfg_slice_0/Dout] [get_bd_pins rx_0/Din] [get_bd_pins nco_0/Din]
connect_bd_net [get_bd_pins const_0/dout] [get_bd_pins rx_0/s_axis_aresetn] [get_bd_pins tx_0/m_axis_aresetn]
connect_bd_net [get_bd_pins cfg_slice_1/Dout] [get_bd_pins tx_0/Din]
connect_bd_net [get_bd_pins txinterpolator_slice_0/Dout] [get_bd_pins tx_0/cfg_data]
connect_bd_net [get_bd_pins rx_0/rd_data_count] [get_bd_pins sts_0/sts_data]
connect_bd_net [get_bd_pins ps_0/FCLK_RESET0_N] [get_bd_pins rst_0/ext_reset_in]
connect_bd_net [get_bd_pins micro_sequencer/pulse] [get_bd_pins xled_slice_0/Din] [get_bd_pins trigger_slice_0/Din] [get_bd_pins txgate_slice_0/Din]
connect_bd_net [get_bd_pins xled_slice_0/Dout] [get_bd_ports led_o]
connect_bd_net [get_bd_pins trigger_slice_0/Dout] [get_bd_pins tx_0/Din1] [get_bd_pins rx_0/Din1] [get_bd_pins grad_bram_enb_slice/Din]
connect_bd_net [get_bd_pins micro_sequencer/tx_offset] [get_bd_pins tx_0/current_offset]
connect_bd_net [get_bd_pins txgate_slice_0/Dout] [get_bd_pins nio_concat_0/In1]
connect_bd_net [get_bd_pins nio_concat_0/dout] [get_bd_ports exp_n_tri_io]
connect_bd_net [get_bd_pins serial_attenuator/attn_clk] [get_bd_pins pio_concat_0/In0]
connect_bd_net [get_bd_pins serial_attenuator/attn_serial] [get_bd_pins pio_concat_0/In1]
connect_bd_net [get_bd_pins serial_attenuator/attn_le] [get_bd_pins pio_concat_0/In2]
connect_bd_net [get_bd_pins pio_concat_0/dout] [get_bd_ports exp_p_tri_io]
connect_bd_net [get_bd_pins grad_bram_offset_slice/Dout] [get_bd_pins ocra_grad_ctrl_0/grad_bram_offset_i]
connect_bd_net [get_bd_pins micro_sequencer/grad_offset] [get_bd_pins grad_bram_offset_slice/Din]
connect_bd_net [get_bd_pins grad_bram_enb_slice/Dout] [get_bd_pins ocra_grad_ctrl_0/grad_bram_enb_i]
connect_bd_net [get_bd_pins ocra_grad_ctrl_0/fhd_ssn_o] [get_bd_pins pio_concat_0/In4]
connect_bd_net [get_bd_pins ocra_grad_ctrl_0/fhd_sdo_o] [get_bd_pins pio_concat_0/In5]
connect_bd_net [get_bd_pins ocra_grad_ctrl_0/oc1_clk_o] [get_bd_pins spiconcat_0/In0]
connect_bd_net [get_bd_pins ocra_grad_ctrl_0/oc1_syncn_o] [get_bd_pins spiconcat_0/In1]
connect_bd_net [get_bd_pins ocra_grad_ctrl_0/oc1_ldacn_o] [get_bd_pins spiconcat_0/In2]
connect_bd_net [get_bd_pins ocra_grad_ctrl_0/oc1_sdox_o] [get_bd_pins spiconcat_0/In3]
connect_bd_net [get_bd_pins ocra_grad_ctrl_0/oc1_sdoy_o] [get_bd_pins spiconcat_0/In4]
connect_bd_net [get_bd_pins ocra_grad_ctrl_0/oc1_sdoz_o] [get_bd_pins spiconcat_0/In5]
connect_bd_net [get_bd_pins ocra_grad_ctrl_0/oc1_sdoz2_o] [get_bd_pins spiconcat_0/In6]
connect_bd_net [get_bd_pins spiconcat_0/dout] [get_bd_pins nio_concat_0/In0]
connect_bd_net [get_bd_pins ocra_grad_ctrl_0/fhd_clk_o] [get_bd_pins pio_concat_0/In3]
connect_bd_net [get_bd_pins ps_0/FCLK_CLK0] \
  [get_bd_pins cfg_0/aclk] [get_bd_pins ps_0_axi_periph/M00_ACLK] [get_bd_pins micro_sequencer/S_AXI_ACLK] \
  [get_bd_pins ps_0_axi_periph/M05_ACLK] [get_bd_pins ps_0_axi_periph/M07_ACLK] [get_bd_pins ps_0/M_AXI_GP0_ACLK] \
  [get_bd_pins ps_0_axi_periph/S00_ACLK] [get_bd_pins ps_0_axi_periph/ACLK] [get_bd_pins ps_0_axi_periph/M01_ACLK] \
  [get_bd_pins sts_0/aclk] [get_bd_pins ps_0_axi_periph/M02_ACLK] [get_bd_pins rx_0/m_axis_aclk] \
  [get_bd_pins ps_0_axi_periph/M03_ACLK] [get_bd_pins tx_0/aclk] [get_bd_pins ps_0_axi_periph/M04_ACLK] \
  [get_bd_pins sequence_writer/aclk] [get_bd_pins ps_0_axi_periph/M06_ACLK] [get_bd_pins serial_attenuator/S_AXI_ACLK] \
  [get_bd_pins rst_0/slowest_sync_clk] [get_bd_pins nco_0/aclk] [get_bd_pins ps_0_axi_periph/M08_ACLK] \
  [get_bd_pins ocra_grad_ctrl_0/s00_axi_aclk] [get_bd_pins ocra_grad_ctrl_0/s_axi_intr_aclk]
connect_bd_net [get_bd_ports exp_p_tri_io_i] [get_bd_pins ocra_grad_ctrl_0/fhd_sdi_i]

# ---- address map ----
assign_bd_address -offset 0x40000000 -range 4K -target_address_space [get_bd_addr_spaces ps_0/Data] [get_bd_addr_segs cfg_0/s_axi/reg0]
assign_bd_address -offset 0x40001000 -range 4K -target_address_space [get_bd_addr_spaces ps_0/Data] [get_bd_addr_segs sts_0/s_axi/reg0]
assign_bd_address -offset 0x40010000 -range 64K -target_address_space [get_bd_addr_spaces ps_0/Data] [get_bd_addr_segs rx_0/reader_0/s_axi/reg0]
assign_bd_address -offset 0x40020000 -range 64K -target_address_space [get_bd_addr_spaces ps_0/Data] [get_bd_addr_segs tx_0/writer_0/s_axi/reg0]
assign_bd_address -offset 0x40030000 -range 64K -target_address_space [get_bd_addr_spaces ps_0/Data] [get_bd_addr_segs sequence_writer/s_axi/reg0]
assign_bd_address -offset 0x40040000 -range 64K -target_address_space [get_bd_addr_spaces ps_0/Data] [get_bd_addr_segs micro_sequencer/S_AXI/reg0]
assign_bd_address -offset 0x40050000 -range 64K -target_address_space [get_bd_addr_spaces ps_0/Data] [get_bd_addr_segs serial_attenuator/S_AXI/reg0]
assign_bd_address -offset 0x40100000 -range 1M -target_address_space [get_bd_addr_spaces ps_0/Data] [get_bd_addr_segs ocra_grad_ctrl_0/s00_axi/reg0]
assign_bd_address -offset 0x43C00000 -range 64K -target_address_space [get_bd_addr_spaces ps_0/Data] [get_bd_addr_segs ocra_grad_ctrl_0/s_axi_intr/reg0]

validate_bd_design
save_bd_design
